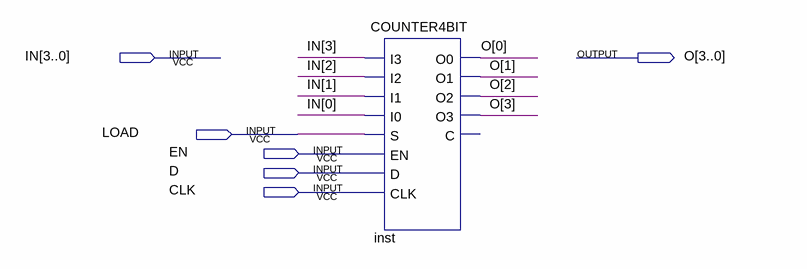
[diagram p0: schematic sheet]
// Quartus schematic PC.bdf as structural Verilog: 1 symbols, 6 pins
module PC (
  input  [3:0] IN,
  input  LOAD,
  input  EN,
  input  D,
  input  CLK,
  output [3:0] O
);

  COUNTER4BIT inst (
    .I3(IN[3]), .I2(IN[2]), .I1(IN[1]), .I0(IN[0]), .S(LOAD), .EN(EN), .D(D), .CLK(CLK), .O0(O[0]),
    .O1(O[1]), .O2(O[2]), .O3(O[3]));  // open: C
endmodule
